# Altium schematic sheet main.SchDoc
size 594 x 420 mm; Organization: Altium Limited; Address1: L3, 12a Rodborough Rd; Address2: Frenchs Forest; Address3: NSW; Address4: Australia 2086
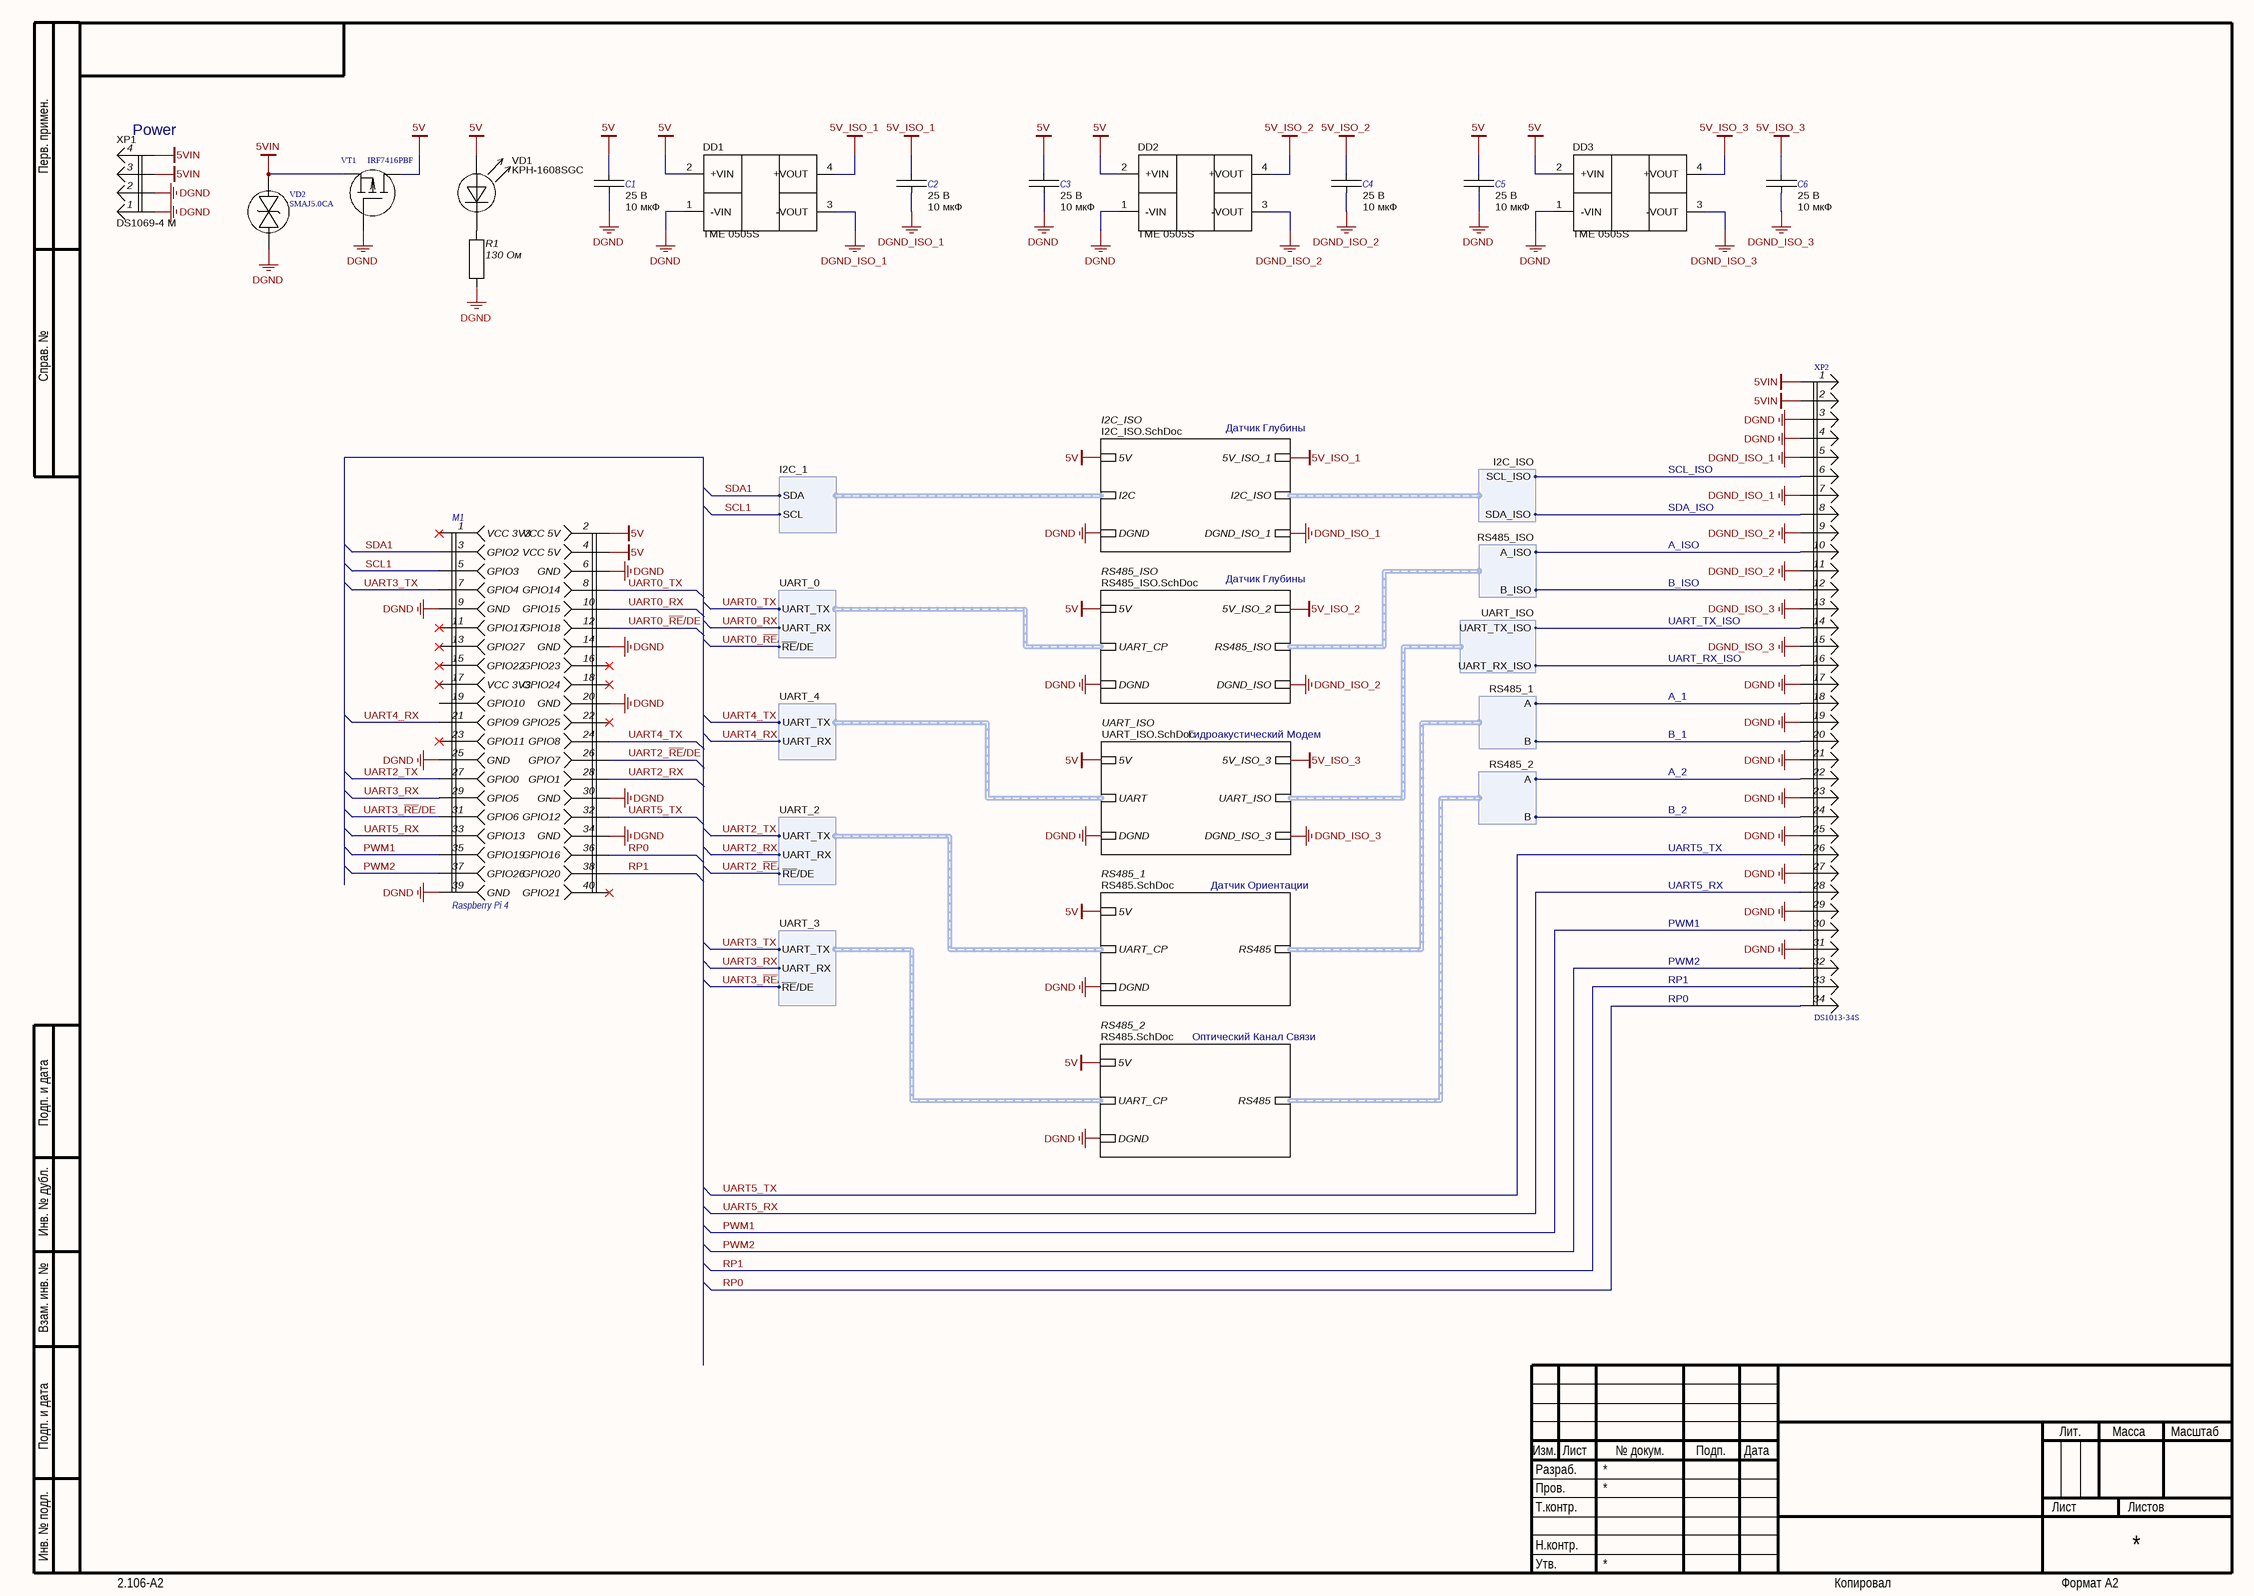
[diagram p0: main.SchDoc]

## Parts
C1  Voltage: 25 В  [C1206C]  (hidden comment: 10 мкФ)
C2  Voltage: 25 В  [C1206C]  (hidden comment: 10 мкФ)
C3  Voltage: 25 В  [C1206C]  (hidden comment: 10 мкФ)
C4  Voltage: 25 В  [C1206C]  (hidden comment: 10 мкФ)
C5  Voltage: 25 В  [C1206C]  (hidden comment: 10 мкФ)
C6  Voltage: 25 В  [C1206C]  (hidden comment: 10 мкФ)
DD1  TME 0505S  [TME-1W-SINGLE]
DD2  TME 0505S  [TME-1W-SINGLE]
DD3  TME 0505S  [TME-1W-SINGLE]
M1  Raspberry Pi 4  [Raspberry Pi 4]
R1  130 Ом  [C0603R]
VD1  KPH-1608SGC  [LED_0603]
VD2  SMAJ5.0CA  [DO-214AC]
VT1  IRF7416PBF  [SOIC-8]
XP1  DS1069-4 M  [DS1069-4 M]
XP2  DS1013-34S  [IDC-34MS]

## Sub-sheets
I2C_ISO = I2C_ISO.SchDoc: DGND, 5V, I2C (harness I2C_1), 5V_ISO_1, I2C_ISO (harness I2C_ISO), DGND_ISO_1
RS485_1 = RS485.SchDoc: DGND, 5V, UART_CP (harness UART_2), RS485 (harness RS485_1)
RS485_2 = RS485.SchDoc: DGND, 5V, UART_CP (harness UART_3), RS485 (harness RS485_2)
RS485_ISO = RS485_ISO.SchDoc: DGND, 5V, UART_CP (harness UART_0), 5V_ISO_2, DGND_ISO, RS485_ISO (harness RS485_ISO)
UART_ISO = UART_ISO.SchDoc: DGND, 5V, UART (harness UART_4), DGND_ISO_3, UART_ISO (harness UART_ISO), 5V_ISO_3

## Harnesses
I2C_1: SDA, SCL
I2C_ISO: SDA_ISO, SCL_ISO
UART_2: UART_TX, UART_RX, ~{RE}/DE
UART_4: UART_TX, UART_RX
UART_0: UART_TX, UART_RX, ~{RE}/DE
UART_3: ~{RE}/DE, UART_RX, UART_TX
RS485_ISO: B_ISO, A_ISO
UART_ISO: UART_TX_ISO, UART_RX_ISO
RS485_1: B, A
RS485_2: B, A

## Nets
5V: C1.1 C3.1 C5.1 DD1.2(+VIN) DD2.2(+VIN) DD3.2(+VIN) M1.2(VCC_5V) M1.4(VCC_5V) VD1.2 VT1.5(D) ; sheet RS485_1/5V, sheet RS485_ISO/5V, sheet UART_ISO/5V, sheet I2C_ISO/5V, sheet RS485_2/5V
5V_ISO_1: C2.1 DD1.4(+VOUT) ; sheet I2C_ISO/5V_ISO_1
5V_ISO_2: C4.1 DD2.4(+VOUT) ; sheet RS485_ISO/5V_ISO_2
5V_ISO_3: C6.1 DD3.4(+VOUT) ; sheet UART_ISO/5V_ISO_3
5VIN: VD2.1(C) VT1.1(S) XP1.3 XP1.4 XP2.1 XP2.2
D: VT1.6(D) VT1.7(D) VT1.8(D)
DGND: C1.2 C3.2 C5.2 DD1.1(-VIN) DD2.1(-VIN) DD3.1(-VIN) M1.6(GND) M1.9(GND) M1.14(GND) M1.20(GND) M1.25(GND) M1.30(GND) M1.34(GND) M1.39(GND) R1.2 VD2.2(A) VT1.4(G) XP1.1 XP1.2 XP2.3 XP2.4 XP2.17 XP2.19 XP2.21 XP2.23 XP2.25 XP2.27 XP2.29 XP2.31 ; sheet RS485_1/DGND, sheet RS485_ISO/DGND, sheet UART_ISO/DGND, sheet I2C_ISO/DGND, sheet RS485_2/DGND
DGND_ISO_1: C2.2 DD1.3(-VOUT) XP2.5 XP2.7 ; sheet I2C_ISO/DGND_ISO_1
DGND_ISO_2: C4.2 DD2.3(-VOUT) XP2.9 XP2.11 ; sheet RS485_ISO/DGND_ISO
DGND_ISO_3: C6.2 DD3.3(-VOUT) XP2.13 XP2.15 ; sheet UART_ISO/DGND_ISO_3
S: VT1.2(S) VT1.3(S)
PWM1: M1.35(GPIO19) XP2.30
PWM2: M1.37(GPIO26) XP2.32
RP0: M1.36(GPIO16) XP2.34
RP1: M1.38(GPIO20) XP2.33
SCL1: M1.5(GPIO3) ; sheet I2C_ISO/I2C.SCL
SDA1: M1.3(GPIO2) ; sheet I2C_ISO/I2C.SDA
UART0_~{RE}/DE: M1.12(GPIO18) ; sheet RS485_ISO/UART_CP.~{RE}/DE
UART0_RX: M1.10(GPIO15) ; sheet RS485_ISO/UART_CP.UART_RX
UART0_TX: M1.8(GPIO14) ; sheet RS485_ISO/UART_CP.UART_TX
UART2_~{RE}/DE: M1.26(GPIO7) ; sheet RS485_1/UART_CP.~{RE}/DE
UART2_RX: M1.28(GPIO1) ; sheet RS485_1/UART_CP.UART_RX
UART2_TX: M1.27(GPIO0) ; sheet RS485_1/UART_CP.UART_TX
UART3_~{RE}/DE: M1.31(GPIO6) ; sheet RS485_2/UART_CP.~{RE}/DE
UART3_RX: M1.29(GPIO5) ; sheet RS485_2/UART_CP.UART_RX
UART3_TX: M1.7(GPIO4) ; sheet RS485_2/UART_CP.UART_TX
UART4_RX: M1.21(GPIO9) ; sheet UART_ISO/UART.UART_RX
UART4_TX: M1.24(GPIO8) ; sheet UART_ISO/UART.UART_TX
UART5_RX: M1.33(GPIO13) XP2.28
UART5_TX: M1.32(GPIO12) XP2.26
NetR1_1: R1.1 VD1.1
NetXP2_6: XP2.6 ; sheet I2C_ISO/I2C_ISO.SCL_ISO
NetXP2_8: XP2.8 ; sheet I2C_ISO/I2C_ISO.SDA_ISO
NetXP2_10: XP2.10 ; sheet RS485_ISO/RS485_ISO.A_ISO
NetXP2_12: XP2.12 ; sheet RS485_ISO/RS485_ISO.B_ISO
NetXP2_14: XP2.14 ; sheet UART_ISO/UART_ISO.UART_TX_ISO
NetXP2_16: XP2.16 ; sheet UART_ISO/UART_ISO.UART_RX_ISO
NetXP2_18: XP2.18 ; sheet RS485_1/RS485.A
NetXP2_20: XP2.20 ; sheet RS485_1/RS485.B
NetXP2_22: XP2.22 ; sheet RS485_2/RS485.A
NetXP2_24: XP2.24 ; sheet RS485_2/RS485.B

Not connected (* = marked no-connect by the designer): M1 1(VCC_3V3)* 11(GPIO17)* 13(GPIO27)* 15(GPIO22)* 16(GPIO23)* 17(VCC_3V3)* 18(GPIO24)* 19(GPIO10) 22(GPIO25)* 23(GPIO11)* 40(GPIO21)*

## Notes on the sheet
- (near XP1) Power
- Датчик Глубины
- SCL_ISO
- SDA_ISO
- A_ISO
- B_ISO
- UART_TX_ISO
- UART_RX_ISO
- A_1
- Гидроакустический Модем
- B_1
- A_2
- B_2
- Датчик Ориентации
- UART5_TX
- UART5_RX
- PWM1
- PWM2
- RP1
- RP0
- Оптический Канал Связи
- Перв. примен.
- Справ. №
- Подп. и дата
- Инв. № дубл.
- Взам. инв. №
- Разраб.
- Изм.
- Лист
- № докум.
- Подп.
- Дата
- Лит.
- Масса
- Масштаб
- Пров.
- Т.контр.
- Листов
- Инв. № подл.
- Утв.
- Н.контр.
- 2.106-A2
- Копировал
- Формат А2

## Library data of the parts
C1-C6 = CC1206KKX7R8BB106: SMD 1206; X7R; 10 мкФ; 25 В; Manufacturer: YAGEO; Persent: ±15%; Type: Ceramic; Part Number: CC1206KKX7R8BB106; Package: SMD 1206; Dielectric: X7R; ComponentLink1Description: Datasheet; Value: 10 мкФ
DD1-DD3 = TME 0505S: Switching regulator, 5V; Manufacturer: Traco Power; Part Number: TME 0505S; Type: ISO DC/DC
R1 = RC0603FR-07130RL: SMD 0603; 0,1; 1%; 130 Ом; Manufacturer: Yageo; Power: 0,1; Part Number: RC0603FR-07130RL; Package: SMD 0603; Persent: 1%; Value: 130 Ом; Category: R
VD1 = KPH-1608SGC: 0603 LED GREEN 10 ucd; Manufacturer: Kingbright; Part Number: KPH-1608SGC; Type: LED
VD2 = SMAJ5.0CA: TVS 5 В; Manufacturer: BOURNS; Voltage: 5V; Power: 400W; Part Number: SMAJ5.0CA; Type: TVS
VT1 = IRF7416PBF: P MOSFET; Manufacturer: Infineon; Part Number: IRF7416PBF; Type: MOSFET; Сharacter: P
XP1 = DS1069-4 M: Manufacturer: Connfly; Part Number: DS1069-4 M
XP2 = DS1013-34S: IDC; Manufacturer: Connfly; Part Number: DS1013-34S; Type: IDC
M1 = Raspberry Pi 4: Part Number: Raspberry Pi 4; Type: Module; ComponentLink1Description: Datasheet; Manufacturer: Raspberry